# Altium schematic sheet STM_SPI_Module.SchDoc
size A
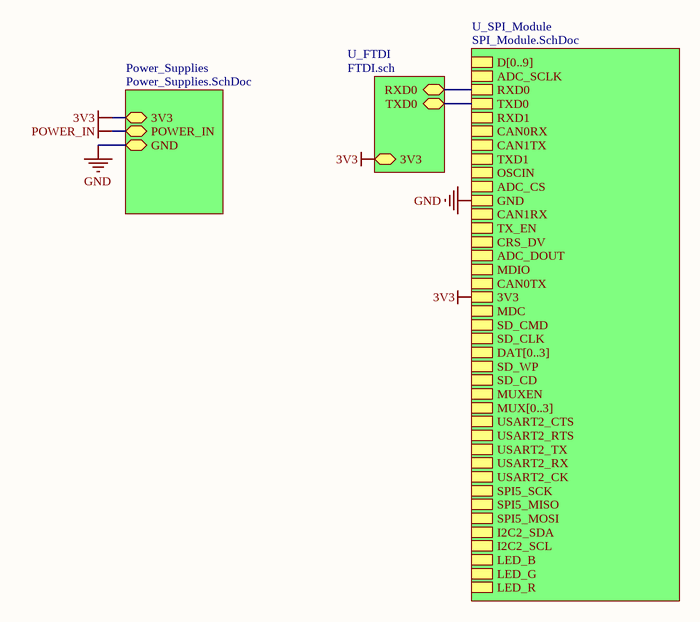
[diagram p0: STM_SPI_Module.SchDoc]

## Sub-sheets
Power_Supplies = Power_Supplies.SchDoc: 3V3, POWER_IN, GND
U_FTDI = FTDI.sch: RXD0 (bidir), TXD0 (bidir), 3V3
U_SPI_Module = SPI_Module.SchDoc: D[0..9], ADC_SCLK, RXD0, TXD0, RXD1, CAN0RX, CAN1TX, TXD1, OSCIN, ADC_CS, GND, CAN1RX, TX_EN, CRS_DV, ADC_DOUT, MDIO, CAN0TX, 3V3, MDC, SD_CMD, SD_CLK, DAT[0..3], SD_WP, SD_CD, MUXEN, MUX[0..3], USART2_CTS, USART2_RTS, USART2_TX, USART2_RX, USART2_CK, SPI5_SCK, SPI5_MISO, SPI5_MOSI, I2C2_SDA, I2C2_SCL, LED_B, LED_G, LED_R

## Nets
3V3: sheet Power_Supplies/3V3, sheet U_FTDI/3V3, sheet U_SPI_Module/3V3
GND: sheet Power_Supplies/GND, sheet U_SPI_Module/GND
POWER_IN: sheet Power_Supplies/POWER_IN
(unnamed): sheet U_FTDI/RXD0, sheet U_SPI_Module/RXD0
(unnamed): sheet U_FTDI/TXD0, sheet U_SPI_Module/TXD0